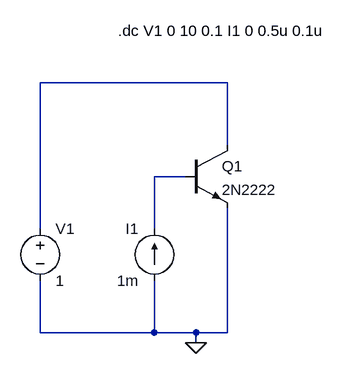
[diagram p0: schematic Labo 1  BJT.asc]
Labo 1  BJT.asc, the LTspice schematic file:
Version 4
SHEET 1 880 680
WIRE 288 208 0 208
WIRE 288 304 288 208
WIRE 224 352 176 352
WIRE 0 432 0 208
WIRE 176 432 176 352
WIRE 0 592 0 512
WIRE 176 592 176 512
WIRE 176 592 0 592
WIRE 240 592 176 592
WIRE 288 592 288 400
WIRE 288 592 240 592
WIRE 240 608 240 592
FLAG 240 608 0
SYMBOL voltage 0 416 R0
WINDOW 123 0 0 Left 0
WINDOW 39 0 0 Left 0
SYMATTR InstName V1
SYMATTR Value 1
SYMBOL npn 224 304 R0
SYMATTR InstName Q1
SYMATTR Value 2N2222
SYMBOL current 176 512 R180
WINDOW 0 24 80 Left 2
WINDOW 3 24 0 Left 2
WINDOW 123 0 0 Left 0
WINDOW 39 0 0 Left 0
SYMATTR InstName I1
SYMATTR Value 1m
TEXT 120 128 Left 2 !.dc V1 0 10 0.1 I1 0 0.5u 0.1u

The netlist it stands for:
* Labo 1  BJT.asc
V1 N001 0 1
Q1 N001 N002 0 0 2N2222
I1 0 N002 1m
.model NPN NPN
.model PNP PNP
.lib standard.bjt
.dc V1 0 10 0.1 I1 0 0.5u 0.1u
.backanno
.end